# EAGLE schematic oven_thermocouples (EAGLE 8.3.2)
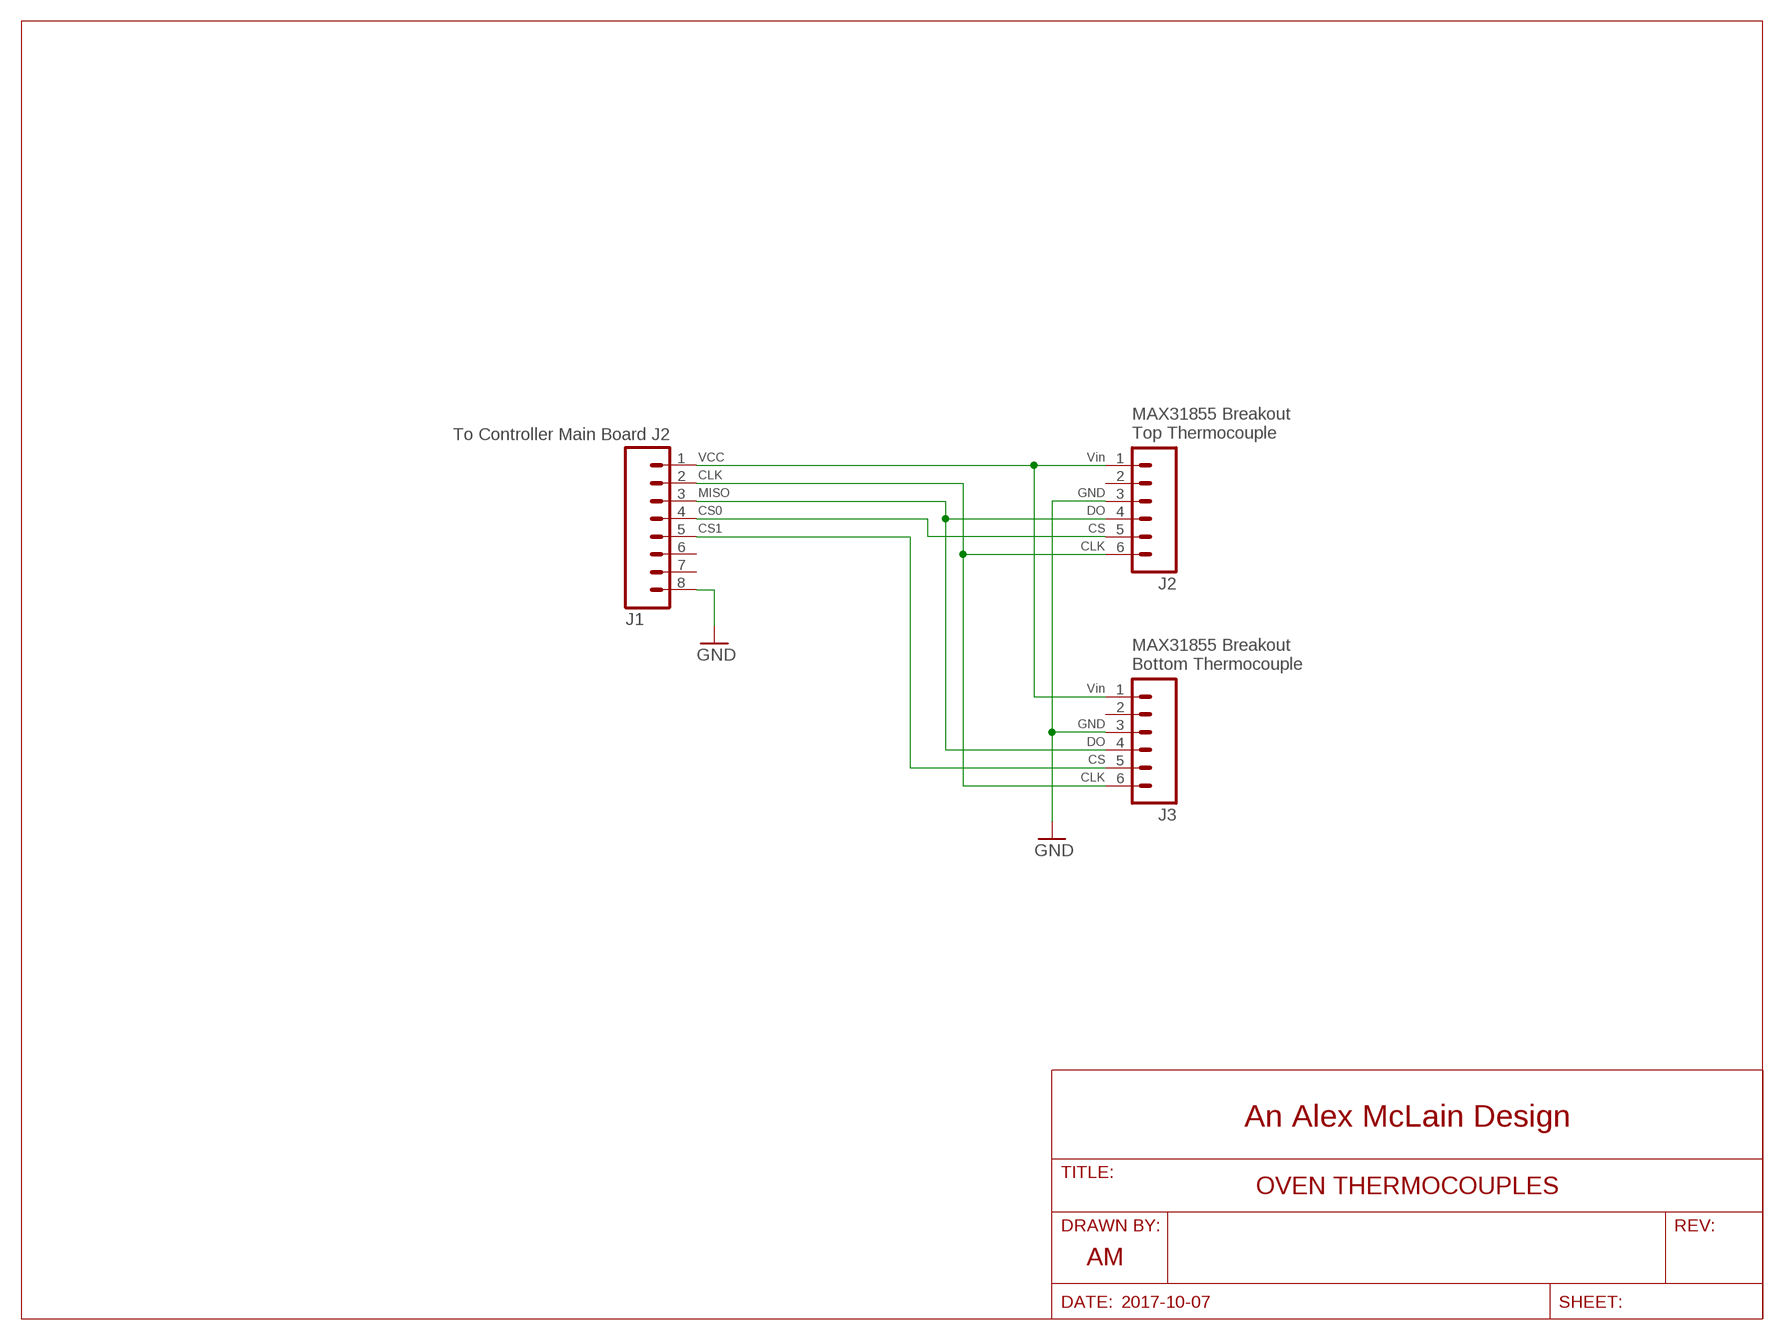
[diagram p0: schematic, sheet 1]
FRAME1 (LETTER_L): COMPANY_NAME: An Alex McLain Design; DATE_DRAWN: 2017-10-07; DRAWN_BY: AM; TITLE: OVEN THERMOCOUPLES

## Parts
J1  MA08  [08PA]
J2  MA06  [06PA]
J3  MA06  [06PA]

## Nets
GND: J1.8 J2.3 J3.3
N$1: J1.2 J2.6 J3.6
N$2: J1.3 J2.4 J3.4
N$3: J1.4 J2.5
N$4: J1.5 J3.5
N$5: J1.1 J2.1 J3.1
Unconnected: J1.6 J1.7 J2.2 J3.2

## Notes on the sheet
- To Controller Main Board J2
- MAX31855 Breakout
  Top Thermocouple
- VCC | Vin
- CLK
- MISO | GND
- CS0 | DO
- CS1 | CS
- CLK
- MAX31855 Breakout
  Bottom Thermocouple
- Vin
- GND
- DO
- CS
- CLK

## Library data of the parts
J1 = con-amp-quick:MA08: AMP QUICK CONNECTOR; OC_FARNELL: unknown; OC_NEWARK: unknown
J2 J3 = con-amp-quick:MA06: AMP QUICK CONNECTOR; OC_FARNELL: unknown; OC_NEWARK: unknown